# EAGLE design tms9918 (EAGLE 9.4.2)

## Sheet 1 of 2: Bus interface
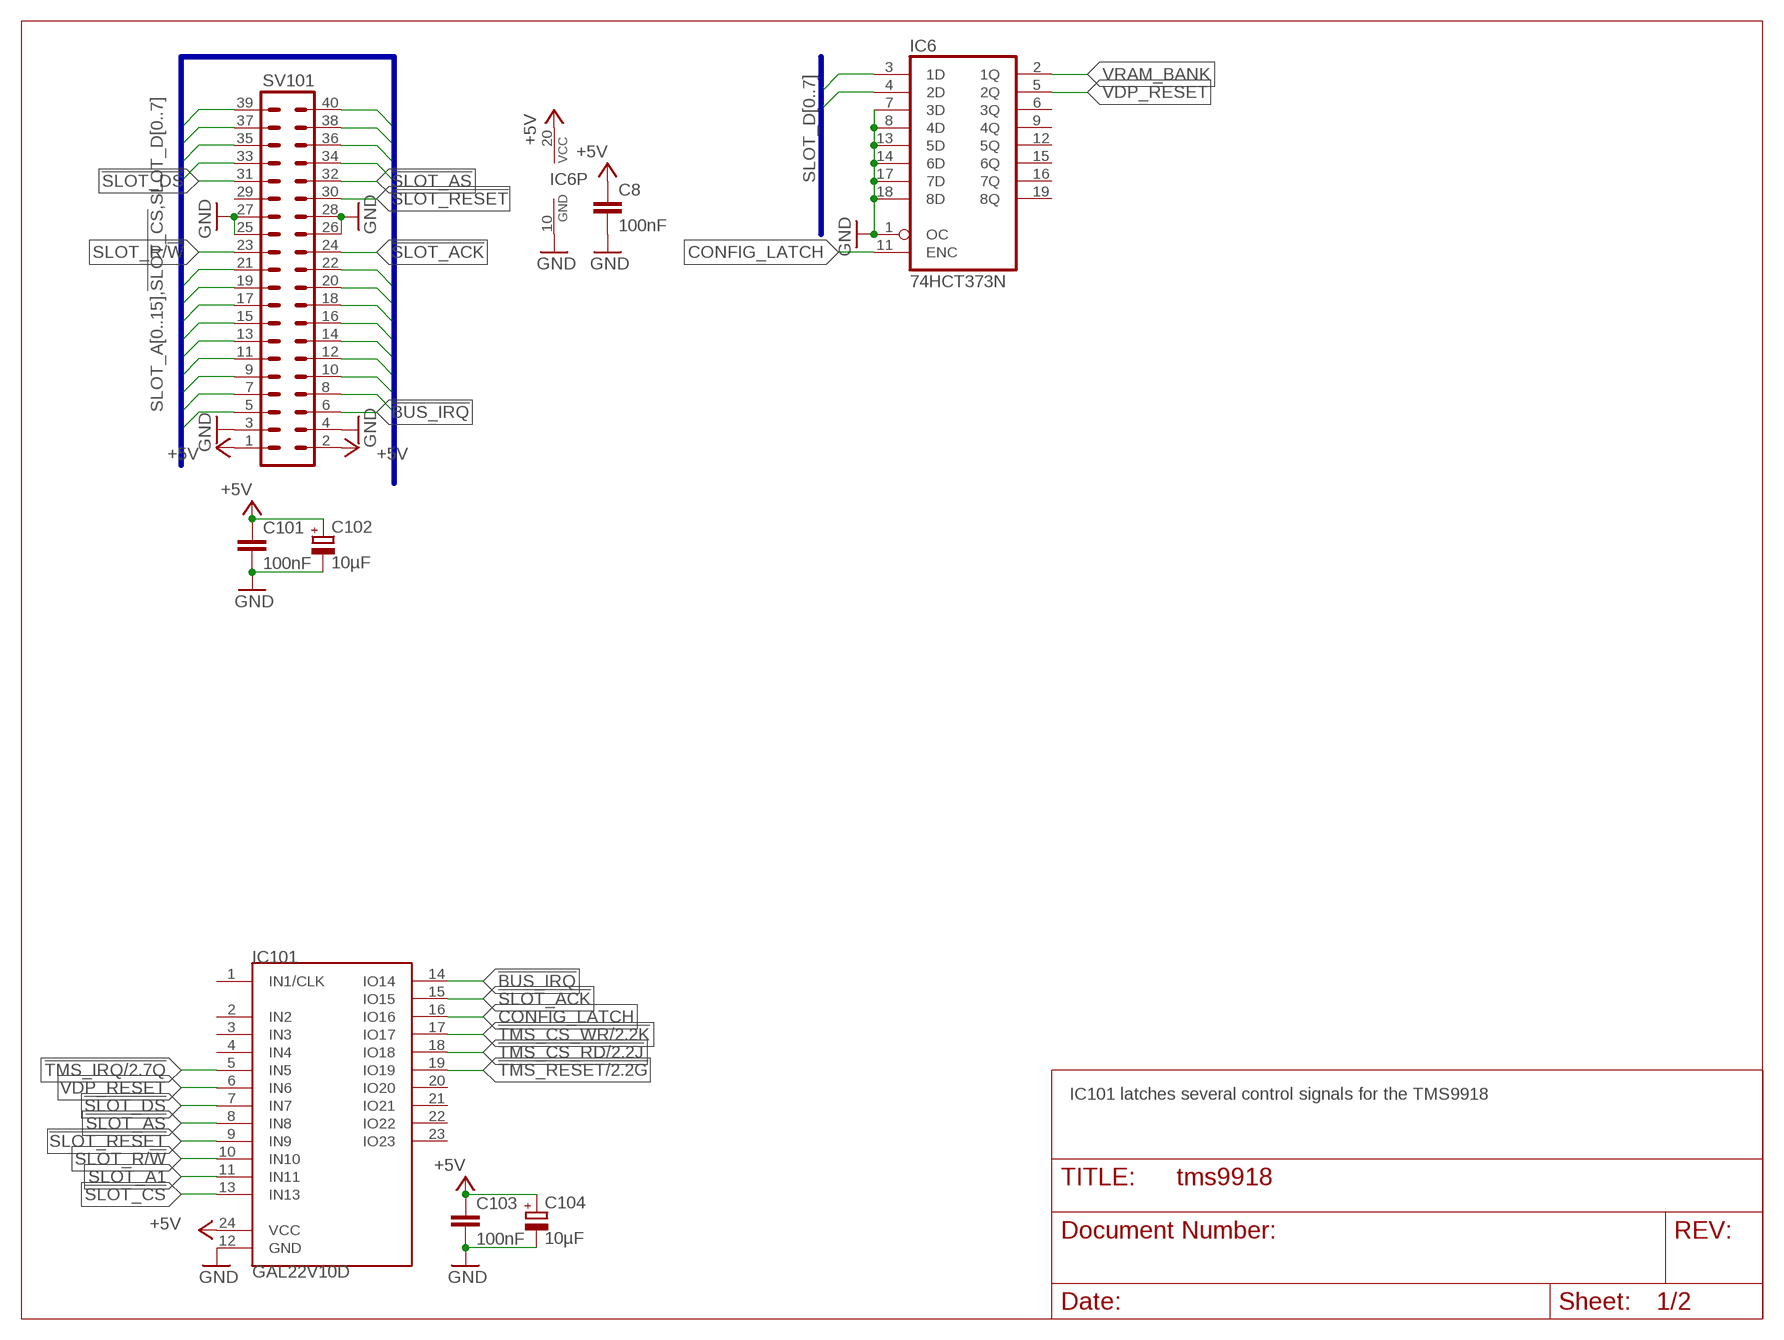
[diagram p0: schematic, sheet 1]

### Parts
C8  100nF  C-EUC0805  [C0805]
C101  100nF  C-EUC0805  [C0805]
C102  10µF  CPOL-EUSMCB  [SMC_B]
C103  100nF  C-EUC0805  [C0805]
C104  10µF  CPOL-EUSMCB  [SMC_B]
IC6  74HCT373N  [DIL20]
IC101  GAL22V10D  GAL22V10DIP24  [DIL24S]
SV101  MA20-2W  [MA20-2W]

### Nets
!BUS_IRQ: IC101.14(IO14) SV101.6
!SLOT_ACK: IC101.15(IO15) SV101.24
!SLOT_AS: IC101.8(IN8) SV101.32
!SLOT_CS: IC101.13(IN13) SV101.5
!SLOT_DS: IC101.7(IN7) SV101.31
!SLOT_RESET: IC101.9(IN9) SV101.30
!TMS_CS_RD: IC101.18(IO18) ; also sheet 2
!TMS_CS_WR: IC101.17(IO17) ; also sheet 2
!TMS_IRQ: IC101.5(IN5) ; also sheet 2
!TMS_RESET: IC101.19(IO19) ; also sheet 2
+5V: C8.1 C101.1 C102.+ C103.1 C104.+ IC6.20(VCC) IC101.24(VCC) SV101.1 SV101.2 ; also sheet 2
CONFIG_LATCH: IC6.11(ENC) IC101.16(IO16)
GND: C8.2 C101.2 C102.- C103.2 C104.- IC6.1(OC) IC6.7(3D) IC6.8(4D) IC6.10(GND) IC6.13(5D) IC6.14(6D) IC6.17(7D) IC6.18(8D) IC101.12(GND) SV101.3 SV101.4 SV101.25 SV101.26 SV101.27 SV101.28 ; also sheet 2
SLOT_A0: SV101.12 ; also sheet 2
SLOT_A1: IC101.11(IN11) SV101.10
SLOT_A2: SV101.8
SLOT_A3: SV101.7
SLOT_A4: SV101.9
SLOT_A5: SV101.11
SLOT_A6: SV101.14
SLOT_A7: SV101.13
SLOT_A8: SV101.16
SLOT_A9: SV101.15
SLOT_A10: SV101.18
SLOT_A11: SV101.17
SLOT_A12: SV101.20
SLOT_A13: SV101.19
SLOT_A14: SV101.22
SLOT_A15: SV101.21
SLOT_D0: IC6.3(1D) SV101.35 ; also sheet 2
SLOT_D1: IC6.4(2D) SV101.37 ; also sheet 2
SLOT_D2: SV101.39 ; also sheet 2
SLOT_D3: SV101.40 ; also sheet 2
SLOT_D4: SV101.38 ; also sheet 2
SLOT_D5: SV101.36 ; also sheet 2
SLOT_D6: SV101.34 ; also sheet 2
SLOT_D7: SV101.33 ; also sheet 2
SLOT_R/!W!: IC101.10(IN10) SV101.23
VDP_RESET: IC6.5(2Q) IC101.6(IN6)
VRAM_BANK: IC6.2(1Q) ; also sheet 2
Unconnected: IC6.6(3Q) IC6.9(4Q) IC6.12(5Q) IC6.15(6Q) IC6.16(7Q) IC6.19(8Q) IC101.1(IN1/CLK) IC101.2(IN2) IC101.3(IN3) IC101.4(IN4) IC101.20(IO20) IC101.21(IO21) IC101.22(IO22) IC101.23(IO23) SV101.29

### Buses
SLOT_A[0..15],!SLOT_CS,SLOT_D[0..7]
SLOT_D[0..7]

### Notes on the sheet
- IC101 latches several control signals for the TMS9918

## Sheet 2 of 2: Video Controller/DRAM Emulation
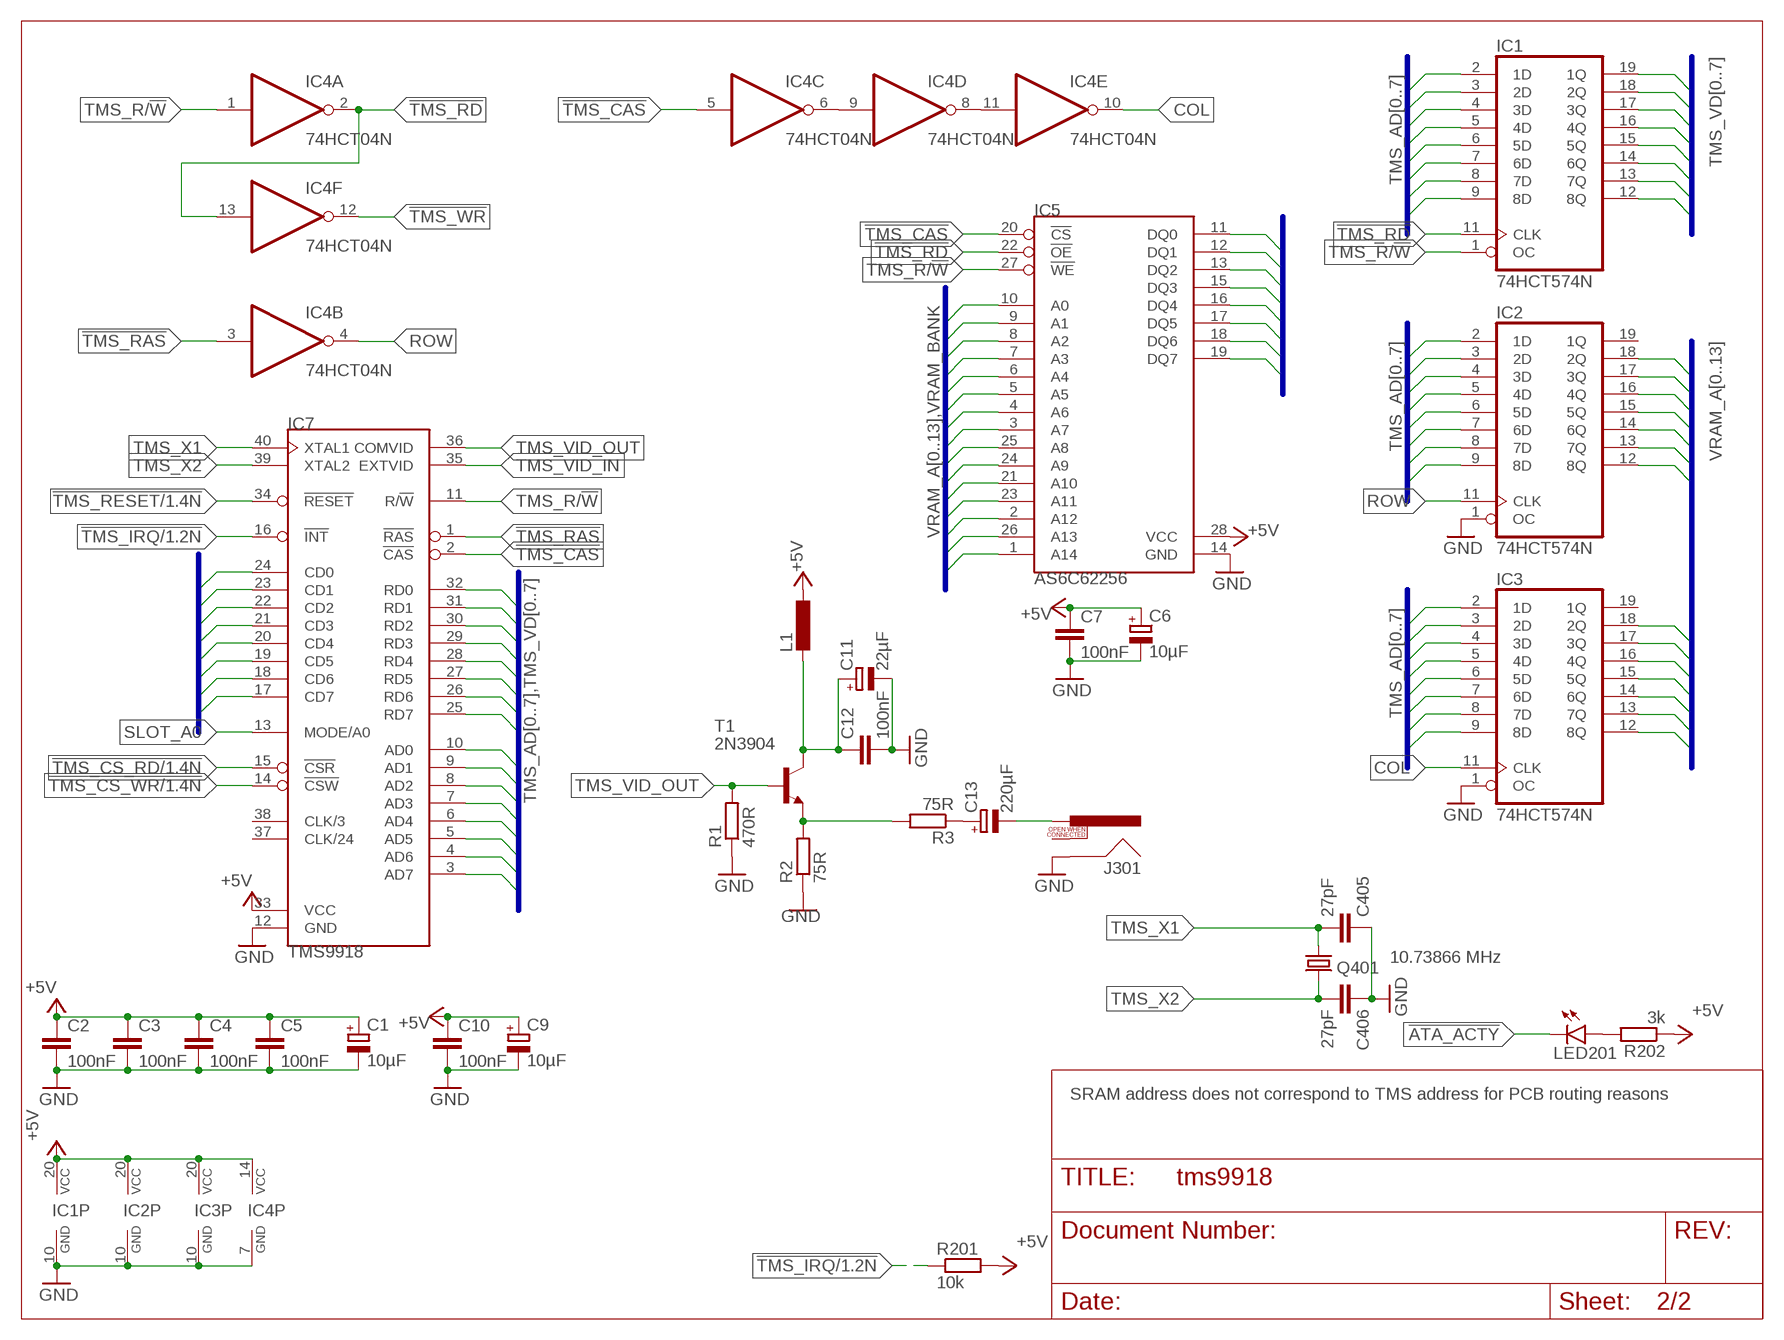
[diagram p1: schematic, sheet 2]

### Parts
C1  10µF  CPOL-EUSMCB  [SMC_B]
C2  100nF  C-EUC0805  [C0805]
C3  100nF  C-EUC0805  [C0805]
C4  100nF  C-EUC0805  [C0805]
C5  100nF  C-EUC0805  [C0805]
C6  10µF  CPOL-EUSMCB  [SMC_B]
C7  100nF  C-EUC0805  [C0805]
C9  10µF  CPOL-EUSMCB  [SMC_B]
C10  100nF  C-EUC0805  [C0805]
C11  22µF  CPOL-EUE2-5  [E2-5]
C12  100nF  C-EUC0805  [C0805]
C13  220µF  CPOL-EUE2.5-7  [E2,5-7]
C405  27pF  C-EUC0805  [C0805]
C406  27pF  C-EUC0805  [C0805]
IC1  74HCT574N  [DIL20]
IC2  74HCT574N  [DIL20]
IC3  74HCT574N  [DIL20]
IC4  74HCT04N  [DIL14]
IC5  AS6C62256  [DIL28-6]
IC7  TMS9918  [DIL40]
J301  RCALOCK  [RCA_LOCK]
L1  L-EUL2012C  [L2012C]
LED201  LEDCHIPLED_1206  [CHIPLED_1206]
Q401  10.73866 MHz  CRYSTALHC49S  [HC49/S]
R1  470R  R-EU_R2012  [R2012]
R2  75R  R-EU_R2012  [R2012]
R3  75R  R-EU_R2012  [R2012]
R201  10k  R-EU_R2012  [R2012]
R202  3k  R-EU_R2012  [R2012]
T1  2N3904  [TO92]

### Nets
!ATA_ACTY: LED201.C
!TMS_CAS: IC4.5(C:I) IC5.20(!CS) IC7.2(!CAS)
!TMS_CS_RD: IC7.15(!CSR) ; also sheet 1
!TMS_CS_WR: IC7.14(!CSW) ; also sheet 1
!TMS_IRQ: IC7.16(!INT) R201.1 ; also sheet 1
!TMS_RAS: IC4.3(B:I) IC7.1(!RAS)
!TMS_RD: IC1.11(CLK) IC4.2(A:O) IC4.13(F:I) IC5.22(!OE)
!TMS_RESET: IC7.34(!RESET) ; also sheet 1
!TMS_WR: IC4.12(F:O)
+5V: C1.+ C2.1 C3.1 C4.1 C5.1 C6.+ C7.1 C9.+ C10.1 IC1.20(VCC) IC2.20(VCC) IC3.20(VCC) IC4.14(P:VCC) IC5.28(VCC) IC7.33(VCC) L1.1 R201.2 R202.1 ; also sheet 1
COL: IC3.11(CLK) IC4.10(E:O)
GND: C1.- C2.2 C3.2 C4.2 C5.2 C6.- C7.2 C9.- C10.2 C11.- C12.2 C405.1 C406.1 IC1.10(GND) IC2.1(OC) IC2.10(GND) IC3.1(OC) IC3.10(GND) IC4.7(P:GND) IC5.14(GND) IC7.12(GND) J301.SHELL R1.1 R2.1 ; also sheet 1
N$1: IC4.8(D:O) IC4.11(E:I)
N$2: IC4.6(C:O) IC4.9(D:I)
N$3: C11.+ C12.1 L1.2 T1.1(C)
N$4: R2.2 R3.2 T1.3(E)
N$5: C13.+ R3.1
N$6: C13.- J301.PIN
N$7: LED201.A R202.2
ROW: IC2.11(CLK) IC4.4(B:O)
SLOT_A0: IC7.13(MODE/A0) ; also sheet 1
SLOT_D0: IC7.17(CD7) ; also sheet 1
SLOT_D1: IC7.18(CD6) ; also sheet 1
SLOT_D2: IC7.19(CD5) ; also sheet 1
SLOT_D3: IC7.20(CD4) ; also sheet 1
SLOT_D4: IC7.21(CD3) ; also sheet 1
SLOT_D5: IC7.22(CD2) ; also sheet 1
SLOT_D6: IC7.23(CD1) ; also sheet 1
SLOT_D7: IC7.24(CD0) ; also sheet 1
TMS_AD0: IC1.2(1D) IC2.9(8D) IC3.9(8D) IC7.10(AD0)
TMS_AD1: IC1.3(2D) IC2.8(7D) IC3.8(7D) IC7.9(AD1)
TMS_AD2: IC1.4(3D) IC2.7(6D) IC3.7(6D) IC7.8(AD2)
TMS_AD3: IC1.5(4D) IC2.6(5D) IC3.6(5D) IC7.7(AD3)
TMS_AD4: IC1.6(5D) IC2.5(4D) IC3.5(4D) IC7.6(AD4)
TMS_AD5: IC1.7(6D) IC2.4(3D) IC3.4(3D) IC7.5(AD5)
TMS_AD6: IC1.8(7D) IC2.3(2D) IC3.3(2D) IC7.4(AD6)
TMS_AD7: IC1.9(8D) IC2.2(1D) IC3.2(1D) IC7.3(AD7)
TMS_R/!W!: IC1.1(OC) IC4.1(A:I) IC5.27(!WE) IC7.11(R/!W!)
TMS_VD0: IC1.19(1Q) IC5.11(DQ0) IC7.32(RD0)
TMS_VD1: IC1.18(2Q) IC5.12(DQ1) IC7.31(RD1)
TMS_VD2: IC1.17(3Q) IC5.13(DQ2) IC7.30(RD2)
TMS_VD3: IC1.16(4Q) IC5.15(DQ3) IC7.29(RD3)
TMS_VD4: IC1.15(5Q) IC5.16(DQ4) IC7.28(RD4)
TMS_VD5: IC1.14(6Q) IC5.17(DQ5) IC7.27(RD5)
TMS_VD6: IC1.13(7Q) IC5.18(DQ6) IC7.26(RD6)
TMS_VD7: IC1.12(8Q) IC5.19(DQ7) IC7.25(RD7)
TMS_VID_IN: IC7.35(EXTVID)
TMS_VID_OUT: IC7.36(COMVID) R1.2 T1.2(B)
TMS_X1: C405.2 IC7.40(XTAL1) Q401.1
TMS_X2: C406.2 IC7.39(XTAL2) Q401.2
VRAM_A0: IC2.12(8Q) IC5.10(A0)
VRAM_A1: IC2.13(7Q) IC5.9(A1)
VRAM_A2: IC2.14(6Q) IC5.8(A2)
VRAM_A3: IC2.15(5Q) IC5.7(A3)
VRAM_A4: IC2.16(4Q) IC5.6(A4)
VRAM_A5: IC2.17(3Q) IC5.5(A5)
VRAM_A6: IC2.18(2Q) IC5.4(A6)
VRAM_A7: IC3.17(3Q) IC5.3(A7)
VRAM_A8: IC3.15(5Q) IC5.25(A8)
VRAM_A9: IC3.14(6Q) IC5.24(A9)
VRAM_A10: IC3.12(8Q) IC5.21(A10)
VRAM_A11: IC3.13(7Q) IC5.23(A11)
VRAM_A12: IC3.18(2Q) IC5.2(A12)
VRAM_A13: IC3.16(4Q) IC5.26(A13)
VRAM_BANK: IC5.1(A14) ; also sheet 1
Unconnected: IC2.19(1Q) IC3.19(1Q) IC7.37(CLK/24) IC7.38(CLK/3) J301.SWITCH

### Buses
TMS_VD[0..7]
VRAM_A[0..13]
TMS_AD[0..7]
VRAM_A[0..13],VRAM_BANK
TMS_AD[0..7],TMS_VD[0..7]
SLOT_D[0..7]

### Notes on the sheet
- SRAM address does not correspond to TMS address for PCB routing reasons

## Library data of the parts
C1 C6 C9 C102 C104 = rcl:CPOL-EU: POLARIZED CAPACITOR, European symbol; MOUSER: 581-TAJB106K020RNJV; SPICEPREFIX: C
C2-C5 C7 C8 C10 C12 C101 C103 = rcl:C-EU: CAPACITOR, European symbol; MOUSER: 710-885012207072; SPICEPREFIX: C
C11 = rcl:CPOL-EU: POLARIZED CAPACITOR, European symbol; MOUSER: 710-860010372002; SPICEPREFIX: C
C13 = rcl:CPOL-EU: POLARIZED CAPACITOR, European symbol; MOUSER: 710-860020373010; SPICEPREFIX: C
C405 C406 = rcl:C-EU: CAPACITOR, European symbol; MOUSER: 80-C0805C270K5HACTU; SPICEPREFIX: C
IC1-IC3 = 74xx-eu:74*574: 8-bit D type FLIP FLOP bus driver; MOUSER: 595-SN74HCT574N; MOUSER_SOCKET: 575-1104732041001000
IC4 = 74xx-eu:74*04: Hex INVERTER; MOUSER: 595-SN74HCT04N; MOUSER_SOCKET: 575-1104731441001000
IC5 = 68komputer:AS6C62256: AS6C62256 – 32K x 8 bit SRAM Datasheet <https://www.mouser.com/datasheet/2/12/AS6C62256%2023%20March%202016%20rev1.2-1288423.pdf>; MOUSER: 913-AS6C62256-55PCN; MOUSER_SOCKET: 575-1104762841001000
IC6 = 74xx-eu:74*373: Octal D type transparent LATCH, edge triggered; MOUSER: 595-SN74HCT373N; MOUSER_SOCKET: 575-1104732041001000
IC7 = 68komputer:TMS9918: TMSS9918 – Video Display Processor Datasheet <http://www.bitsavers.org/components/ti/TMS9900/TMS9918A_TMS9928A_TMS9929A_Video_Display_Processors_Data_Manual_Nov82.pdf>; MOUSER_SOCKET: 437-1108764041001101
IC101 = 68komputer:GAL22V10: GAL22V10D – Generic Array Logic Datasheet <http://web.mit.edu/6.115/www/document/gal22v10.pdf>; MOUSER_SOCKET: 575-11044324
J301 = SparkFun-Connectors:RCA: RCA Jack connector This is a right angle RCA jack connecotr. Commonly used for video or audio. Here is the connector we sell at SparkFun: RCA Jack <https://www.sparkfun.com/products/8631> (PRT-08631) Datasheet <http://www.sparkfun.com/datasheets/Prototyping/Connectors/RCA-Jack.pdf> It is not used on any active designs, however it was used on a couple retired products: RCA Jack Breakout [RETIRED] <https://www.sparkfun.com/products/8826> (PRT-08826) SparkFun On Screen Display Breakout - MAX7456 [RETIRED] <https://www.sparkfun.com/products/9168> (BOB-09168) You may also be interested in a cable: RCA Video Cable - 6' <https://www.sparkfun.com/products/11573> (CAB-11573); MOUSER: 502-PJRAN1X1U03AUX
L1 = rcl:L-EU: INDUCTOR, European symbol; MOUSER: 963-BK2125HS101-T; SPICEPREFIX: L
LED201 = led:LED: LED OSRAM: - CHIPLED LG R971, LG N971, LY N971, LG Q971, LY Q971, LO R971, LY R971 LH N974, LH R974 LS Q976, LO Q976, LY Q976 LO Q996 - Hyper CHIPLED LW Q18S LB Q993, LB Q99A, LB R99A - SideLED LS A670, LO A670, LY A670, LG A670, LP A670 LB A673, LV A673, LT A673, LW A673 LH A674 LY A675 LS A676, LA A676, LO A676, LY A676, LW A676 LS A679, LY A679, LG A679 - Hyper Micro SIDELED® LS Y876, LA Y876, LO Y876, LY Y876 LT Y87S - SmartLED LW L88C, LW L88S LB L89C, LB L89S, LG L890 LS L89K, LO L89K, LY L89K LS L896, LA L896, LO L896, LY L896 - TOPLED LS T670, LO T670, LY T670, LG T670, LP T670 LSG T670, LSP T670, LSY T670, LOP T670, LYG T670 LG T671, LOG T671, LSG T671 LB T673, LV T673, LT T673, LW T673 LH T674 LS T676, LA T676, LO T676, LY T676, LB T676, LH T676, LSB T676, LW T676 LB T67C, LV T67C, LT T67C, LS T67K, LO T67K, LY T67K, LW E67C LS E67B, LA E67B, LO E67B, LY E67B, LB E67C, LV E67C, LT E67C LW T67C LS T679, LY T679, LG T679 LS T770, LO T770, LY T770, LG T770, LP T770 LB T773, LV T773, LT T773, LW T773 LH T774 LS E675, LA E675, LY E675, LS T675 LS T776, LA T776, LO T776, LY T776, LB T776 LHGB T686 LT T68C, LB T68C - Hyper Mini TOPLED® LB M676 - Mini TOPLED Santana® LG M470 LS M47K, LO M47K, LY M47K Source: http://www.osram.convergy.de LUXEON: - LUMILED® LXK2-PW12-R00, LXK2-PW12-S00, LXK2-PW14-U00, LXK2-PW14-V00 LXK2-PM12-R00, LXK2-PM12-S00, LXK2-PM14-U00 LXK2-PE12-Q00, LXK2-PE12-R00, LXK2-PE12-S00, LXK2-PE14-T00, LXK2-PE14-U00 LXK2-PB12-K00, LXK2-PB12-L00, LXK2-PB12-M00, LXK2-PB14-N00, LXK2-PB14-P00, LXK2-PB14-Q00 LXK2-PR12-L00, LXK2-PR12-M00, LXK2-PR14-Q00, LXK2-PR14-R00 LXK2-PD12-Q00, LXK2-PD12-R00, LXK2-PD12-S00 LXK2-PH12-R00, LXK2-PH12-S00 LXK2-PL12-P00, LXK2-PL12-Q00, LXK2-PL12-R00 Source: www.luxeon.com KINGBRIGHT: KA-3528ASYC Source: www.kingbright.com; MOUSER: 710-156120VS75300
Q401 = crystal:CRYSTAL: CRYSTAL; MOUSER: 449-LFXTAL029962REEL; OC_FARNELL: 1667008; OC_NEWARK: unknown
R1 = rcl:R-EU_: RESISTOR, European symbol; MOUSER: 652-CR0805FX-4700ELF; SPICEPREFIX: R
R2 R3 = rcl:R-EU_: RESISTOR, European symbol; MOUSER: 652-CR0805FX-75R0ELF; SPICEPREFIX: R
R201 = rcl:R-EU_: RESISTOR, European symbol; MOUSER: 652-CR0805FX-1002ELF; SPICEPREFIX: R
R202 = rcl:R-EU_: RESISTOR, European symbol; MOUSER: 652-CR0805JW-302ELF; SPICEPREFIX: R
SV101 = con-lstb:MA20-2W: PIN HEADER; OC_FARNELL: unknown; OC_NEWARK: unknown
T1 = transistor-neu-to92:2N3904: NPN TRANSISTOR; MOUSER: 512-2N3904BU

## Net classes
0 default: width 0.203 mm

## Board
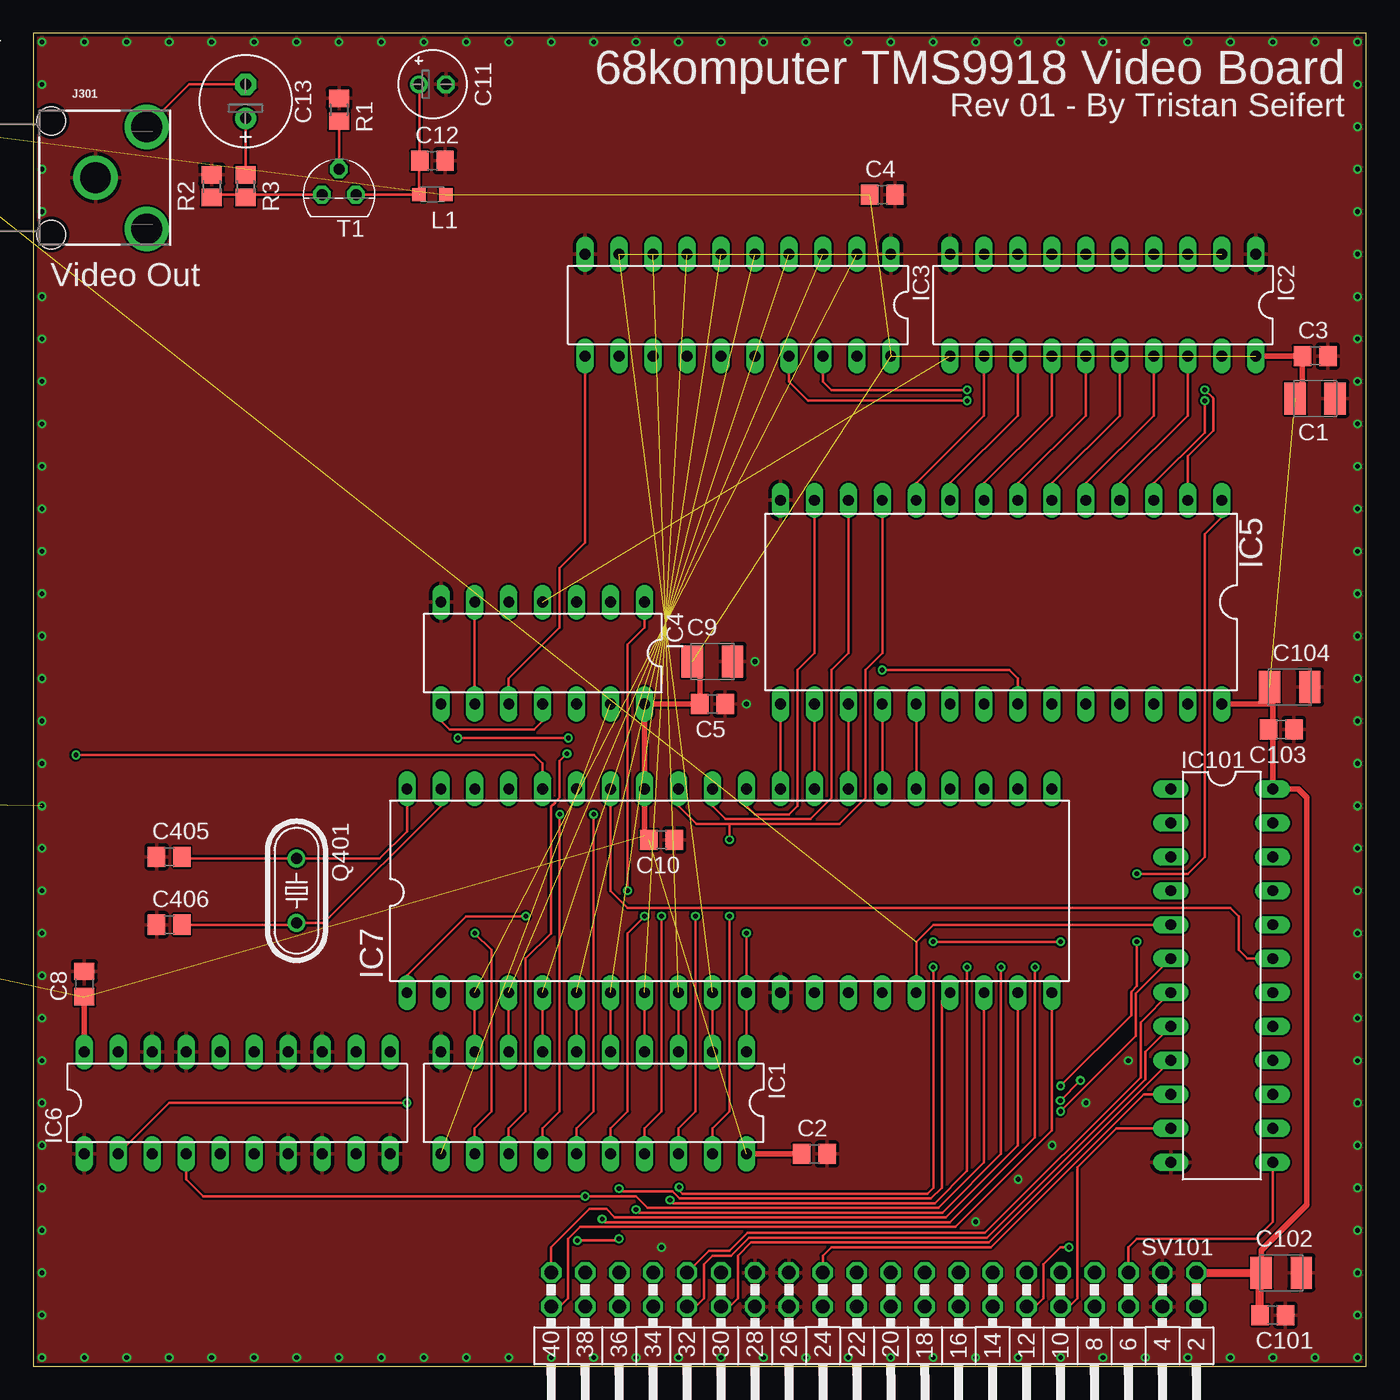
[diagram p2: board, top side]
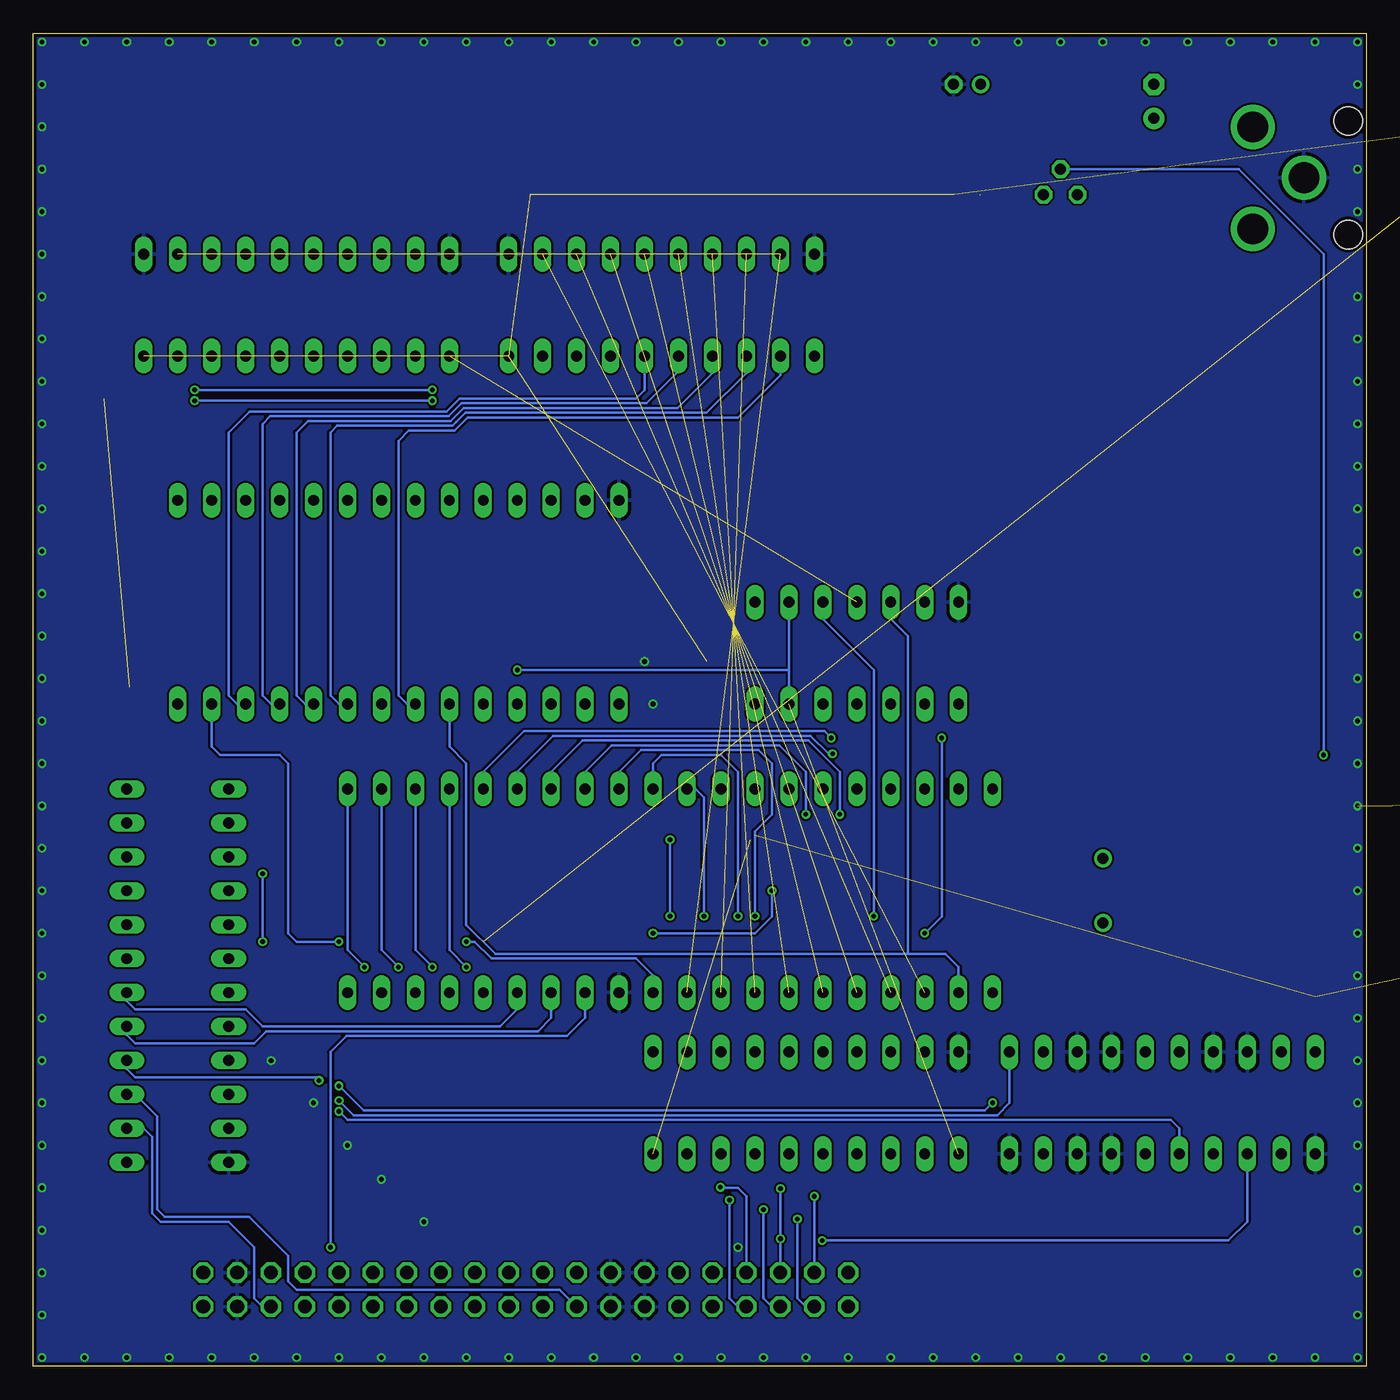
[diagram p3: board, bottom side, seen from below]

Size 99.69 x 99.69 mm. Coordinates in mm from the lower left corner, seen from the top.
Outline: 0,0 99.69,0 99.69,99.69 0,99.69 0,0
Copper layers (1*16): Top 0.035mm / dielectric 1.5mm / Bottom 0.035mm
Design rules "dirt_cheap_dirty_boards.v1.1": minimum track width 6mil, minimum drill 12mil, track to track 6mil, track to pad 6mil, pad to pad 6mil, via to via 6mil, smd to smd 0mil, copper to edge 10mil, drill to drill 10mil, minimum pad ring 10mil, minimum via ring 6mil, stop-mask expansion 2mil, vias tented up to drill 25mil, thermal gap 10mil

### Footprints (pad centres in the part's own frame; a part is rotated, then mirrored left to right if it is on the bottom)
SMC_B = smd 1.6 x 2.4: + -1.5,0; - 1.5,0
C0805 = smd 1.3 x 1.5: 1 -0.95,0; 2 0.95,0
E2-5 = drill 0.813 pad 1.27: + -1.016,0 | drill 0.813 pad 1.27 octagon: - 1.016,0
E2,5-7 = drill 0.813 pad 1.6: + -1.27,0 | drill 0.813 pad 1.6 octagon: - 1.27,0
DIL20 = drill 0.813 long: 1 -11.43,-3.81; 2 -8.89,-3.81; 3 -6.35,-3.81; 4 -3.81,-3.81; 5 -1.27,-3.81; 6 1.27,-3.81; 7 3.81,-3.81; 8 6.35,-3.81; 9 8.89,-3.81; 10 11.43,-3.81; 11 11.43,3.81; 12 8.89,3.81; 13 6.35,3.81; 14 3.81,3.81; 15 1.27,3.81; 16 -1.27,3.81; 17 -3.81,3.81; 18 -6.35,3.81; 19 -8.89,3.81; 20 -11.43,3.81
DIL14 = drill 0.813 long: 1 -7.62,-3.81; 2 -5.08,-3.81; 3 -2.54,-3.81; 4 0,-3.81; 5 2.54,-3.81; 6 5.08,-3.81; 7 7.62,-3.81; 8 7.62,3.81; 9 5.08,3.81; 10 2.54,3.81; 11 0,3.81; 12 -2.54,3.81; 13 -5.08,3.81; 14 -7.62,3.81
DIL28-6 = drill 0.813 long: 1 -16.51,-7.62; 2 -13.97,-7.62; 3 -11.43,-7.62; 4 -8.89,-7.62; 5 -6.35,-7.62; 6 -3.81,-7.62; 7 -1.27,-7.62; 8 1.27,-7.62; 9 3.81,-7.62; 10 6.35,-7.62; 11 8.89,-7.62; 12 11.43,-7.62; 13 13.97,-7.62; 14 16.51,-7.62; 15 16.51,7.62; 16 13.97,7.62; 17 11.43,7.62; 18 8.89,7.62; 19 6.35,7.62; 20 3.81,7.62; 21 1.27,7.62; 22 -1.27,7.62; 23 -3.81,7.62; 24 -6.35,7.62; 25 -8.89,7.62; 26 -11.43,7.62; 27 -13.97,7.62; 28 -16.51,7.62
DIL40 = drill 0.813 long: 1 -24.13,-7.62; 2 -21.59,-7.62; 3 -19.05,-7.62; 4 -16.51,-7.62; 5 -13.97,-7.62; 6 -11.43,-7.62; 7 -8.89,-7.62; 8 -6.35,-7.62; 9 -3.81,-7.62; 10 -1.27,-7.62; 11 1.27,-7.62; 12 3.81,-7.62; 13 6.35,-7.62; 14 8.89,-7.62; 15 11.43,-7.62; 16 13.97,-7.62; 17 16.51,-7.62; 18 19.05,-7.62; 19 21.59,-7.62; 20 24.13,-7.62; 21 24.13,7.62; 22 21.59,7.62; 23 19.05,7.62; 24 16.51,7.62; 25 13.97,7.62; 26 11.43,7.62; 27 8.89,7.62; 28 6.35,7.62; 29 3.81,7.62; 30 1.27,7.62; 31 -1.27,7.62; 32 -3.81,7.62; 33 -6.35,7.62; 34 -8.89,7.62; 35 -11.43,7.62; 36 -13.97,7.62; 37 -16.51,7.62; 38 -19.05,7.62; 39 -21.59,7.62; 40 -24.13,7.62
DIL24S = drill 0.813 long: 1 -13.97,-3.81; 2 -11.43,-3.81; 3 -8.89,-3.81; 4 -6.35,-3.81; 5 -3.81,-3.81; 6 -1.27,-3.81; 7 1.27,-3.81; 8 3.81,-3.81; 9 6.35,-3.81; 10 8.89,-3.81; 11 11.43,-3.81; 12 13.97,-3.81; 13 13.97,3.81; 14 11.43,3.81; 15 8.89,3.81; 16 6.35,3.81; 17 3.81,3.81; 18 1.27,3.81; 19 -1.27,3.81; 20 -3.81,3.81; 21 -6.35,3.81; 22 -8.89,3.81; 23 -11.43,3.81; 24 -13.97,3.81
RCA_LOCK = drill 2.3: PIN 4.03,3.802; SHELL 0.203,0; SWITCH 4.03,-3.827 | hole 2.134: -3.1,4.25; -3.1,-4.25
L2012C = smd 1 x 1: 1 -1,0; 2 1,0
CHIPLED_1206 = smd 1.5 x 1.5: A 0,-1.75; C 0,1.75
HC49/S = drill 0.813: 1 -2.413,0; 2 2.413,0
R2012 = smd 1.3 x 1.5: 1 -0.85,0; 2 0.85,0
MA20-2W = drill 1.016 octagon: 1 -24.13,-1.27; 2 -24.13,1.27; 3 -21.59,-1.27; 4 -21.59,1.27; 5 -19.05,-1.27; 6 -19.05,1.27; 7 -16.51,-1.27; 8 -16.51,1.27; 9 -13.97,-1.27; 10 -13.97,1.27; 11 -11.43,-1.27; 12 -11.43,1.27; 13 -8.89,-1.27; 14 -8.89,1.27; 15 -6.35,-1.27; 16 -6.35,1.27; 17 -3.81,-1.27; 18 -3.81,1.27; 19 -1.27,-1.27; 20 -1.27,1.27; 21 1.27,-1.27; 22 1.27,1.27; 23 3.81,-1.27; 24 3.81,1.27; 25 6.35,-1.27; 26 6.35,1.27; 27 8.89,-1.27; 28 8.89,1.27; 29 11.43,-1.27; 30 11.43,1.27; 31 13.97,-1.27; 32 13.97,1.27; 33 16.51,-1.27; 34 16.51,1.27; 35 19.05,-1.27; 36 19.05,1.27; 37 21.59,-1.27; 38 21.59,1.27; 39 24.13,-1.27; 40 24.13,1.27
TO92 = drill 0.813 octagon: 1 1.27,0; 2 0,1.905; 3 -1.27,0

### Placement (x,y rotation side)
C1  95.89,72.39 0 top
C2  58.42,15.88 0 top
C3  95.89,75.56 0 top
C4  63.5,87.63 0 top
C5  50.8,49.53 0 top
C6  -43.18,37.47 180 top  (outside the outline)
C7  -42.55,42.55 180 top  (outside the outline)
C8  3.81,28.57 90 top
C9  50.8,52.7 0 top
C10  46.99,39.37 0 top
C11  29.84,95.89 0 top
C12  29.84,90.17 0 top
C13  15.88,94.61 90 top
C101  92.71,3.81 0 top
C102  93.34,6.99 0 top
C103  93.34,47.62 0 top
C104  93.98,50.8 0 top
C405  10.16,38.1 0 top
C406  10.16,33.02 0 top
IC1  41.91,19.68 180 top
IC2  80.01,79.38 180 top
IC3  52.7,79.38 180 top
IC4  38.1,53.34 180 top
IC5  72.39,57.15 180 top
IC6  15.24,19.68 0 top
IC7  52.07,35.56 0 top
IC101  88.9,29.21 270 top
J301  4.45,88.9 0 top
L1  29.84,87.63 180 top
LED201  -7.62,97.79 270 top  (outside the outline)
Q401  19.68,35.56 270 top
R1  22.86,93.98 270 top
R2  13.34,88.27 270 top
R3  15.88,88.27 270 top
R201  -12.7,93.34 180 top  (outside the outline)
R202  -12.7,97.79 0 top  (outside the outline)
SV101  62.87,5.71 180 top
T1  22.86,87.63 0 top

### Tracks (layer width: path | path; a pad name or v marks a point on that pad's centre or on a via)
!BUS_IRQ
  Bottom 0.203: SV101.6 82.55,4.45 83.19,5.08 83.19,8.89 85.09,10.79 90.17,10.79 90.81,11.43 90.81,17.14 91.44,17.78 IC101.14
!SLOT_ACK
  Bottom 0.203: SV101.24 60.33,5.71 80.01,5.71 80.64,6.35 80.64,8.26 83.54,11.15 89.89,11.15 90.45,11.71 90.45,18.69 92.08,20.32 IC101.15
!SLOT_AS
  Top 0.203: IC101.8 83.19,23.5 83.19,21.46 71.33,9.6 53.55,9.6 52.2,8.26 50.8,8.26 50.16,7.62 50.16,5.08 49.53,4.45 SV101.32
!SLOT_CS
  Top 0.203: SV101.5 81.92,8.89 82.55,9.53 91.44,9.53 92.71,10.79 IC101.13
!SLOT_DS
  Top 0.203: SV101.31 50.52,8.61 52.05,8.61 53.4,9.96 71.18,9.96 82.83,21.61 82.83,25.73 85.04,27.94 IC101.7
!SLOT_RESET
  Top 0.203: SV101.30 52.07,4.45 52.7,5.08 52.7,8.26 53.7,9.25 71.48,9.25 IC101.9
!TMS_CAS
  Bottom 0.203: IC5.20 68.58,46.35 67.31,45.09 67.31,33.02 65.13,30.84 34.29,30.84 | IC7.2 30.48,29.84 31.47,30.84 34.29,30.84 | IC4.5 35.56,55.88 34.29,54.61 34.29,30.84
!TMS_CS_RD
  Bottom 0.203: IC7.15 63.5,26.67 64.77,25.4 82.55,25.4 83.82,26.67 92.08,26.67 92.71,27.3 IC101.18
!TMS_CS_WR
  Bottom 0.203: IC7.14 60.96,26.04 61.95,25.04 82.27,25.04 83.19,24.13 92.08,24.13 92.71,24.77 IC101.17
!TMS_IRQ  (1 unrouted)
  Top 0.203: IC101.5 67.31,33.02 66.04,31.75 IC7.16
!TMS_RAS  (via drill 0.35)
  Top 0.203: v36.83,33.66 32.38,33.66 27.94,29.21 IC7.1
  Bottom 0.203: IC4.3 40.64,55.88 36.83,52.07 v36.83,33.66
!TMS_RD  (via drill 0.35)  (1 unrouted)
  Top 0.203: v63.5,52.07 73.03,52.07 73.66,51.44 IC5.22
  Bottom 0.203: IC4.2 43.18,52.07 | 43.18,52.07 IC4.13 | v63.5,52.07 43.18,52.07
!TMS_RESET
  Top 0.203: IC7.34 43.18,35.56 44.45,34.29 89.53,34.29 90.17,33.66 90.17,31.11 90.81,30.48 IC101.19
+5V  (11 unrouted)
  Top 0.203: 49.85,52.16 C9.+
  Top 0.406: C104.+ 92.71,50.57 92.71,49.53 | 92.71,49.53 92.71,47.94 C103.1 92.71,47.31 IC101.24 94.61,43.18 95.25,42.55 95.25,12.06 91.84,8.66 C102.+ | IC5.28 92.71,49.53 | IC1.20 C2.1 | IC2.20 C3.1 94.94,72.94 C1.+ | 49.85,52.16 C5.1 IC4.14 IC7.33 45.72,39.69 C10.1 | C8.1 IC6.20
  Top 0.61: SV101.2 SV101.1 C102.+ 91.76,6.9 C101.1
COL
  Top 0.203: IC3.11 41.27,61.59 39.37,59.69 39.37,55.24 35.56,51.44 IC4.10
CONFIG_LATCH  (via drill 0.35)
  Top 0.203: v76.82,19.86 v78.33,21.37
  Bottom 0.203: IC6.11 26.67,19.68 27.58,18.77 75.73,18.77 v76.82,19.86 | v78.33,21.37 78.55,21.59 92.08,21.59 92.71,22.23 IC101.16
GND  (via drill 0.35)  (2 unrouted)
  other vias: 0.64,0.64 0.64,3.81 0.64,6.99 0.64,10.16 0.64,13.34 0.64,16.51 0.64,19.68 0.64,22.86 0.64,26.04 0.64,29.21 0.64,32.38 0.64,35.56 0.64,38.73 0.64,41.91 0.64,45.09 0.64,48.26 0.64,51.44 0.64,54.61 0.64,57.78 0.64,60.96 0.64,64.14 0.64,67.31 0.64,70.48 0.64,73.66 0.64,76.83 0.64,80.01 0.64,86.36 0.64,89.53 0.64,95.89 0.64,99.06 3.81,0.64 6.99,0.64 10.16,0.64 13.34,0.64 16.51,0.64 19.68,0.64 22.86,0.64 26.04,0.64 29.21,0.64 32.38,0.64 35.56,0.64 38.73,0.64 41.91,0.64 45.09,0.64 48.26,0.64 51.44,0.64 54.61,0.64 57.78,0.64 60.96,0.64 64.14,0.64 67.31,0.64 70.48,0.64 73.66,0.64 76.83,0.64 80.01,0.64 83.19,0.64 86.36,0.64 89.53,0.64 92.71,0.64 95.89,0.64 99.06,0.64 99.06,3.81 99.06,6.99 99.06,10.16 99.06,13.34 99.06,16.51 99.06,19.68 99.06,22.86 99.06,26.04 99.06,29.21 99.06,32.38 99.06,35.56 99.06,38.73 99.06,41.91 99.06,45.09 99.06,48.26 99.06,51.44 99.06,54.61 99.06,57.78 99.06,60.96 99.06,64.14 99.06,67.31 99.06,70.48 99.06,73.66 99.06,76.83 99.06,80.01 99.06,83.19 99.06,86.36 99.06,89.53 99.06,92.71 99.06,95.89 99.06,99.06 95.89,99.06 92.71,99.06 89.53,99.06 86.36,99.06 83.19,99.06 80.01,99.06 76.83,99.06 73.66,99.06 70.48,99.06 67.31,99.06 64.14,99.06 60.96,99.06 57.78,99.06 54.61,99.06 51.44,99.06 48.26,99.06 45.09,99.06 41.91,99.06 38.73,99.06 35.56,99.06 32.38,99.06 29.21,99.06 26.04,99.06 22.86,99.06 19.68,99.06 16.51,99.06 13.34,99.06 10.16,99.06 6.99,99.06 3.81,99.06 46.99,8.89 53.34,49.53 53.98,52.7 70.48,10.79 76.2,16.51 78.74,19.68 81.92,22.86 73.66,13.97
  pour Bottom: 0,0 0,99.69 99.69,99.69 99.69,0 0.64,0
  pour Top: 0,0 0,99.69 99.69,99.69 99.69,0 0.64,0
N$1
  Top 0.203: IC4.8 30.48,48.26 31.11,47.62 37.47,47.62 38.1,48.26 IC4.11
N$2
  Top 0.203: IC4.9 IC4.6
N$3  (1 unrouted)
  Top 0.203: 28.89,87.63 T1.1 | C11.+ 28.89,95.82 C12.1 28.84,90.12 L1.2
N$4
  Top 0.203: T1.3 16.09,87.63 R3.2 15.46,87.42 15.24,87.63 13.55,87.63 R2.2
N$5
  Top 0.203: C13.+ R3.1
N$6
  Top 0.203: J301.PIN 11.66,95.89 C13.-
N$7  (1 unrouted)
ROW  (1 unrouted)
SLOT_A0  (via drill 0.35)
  Top 0.203: SV101.12 74.93,4.45 75.56,5.08 75.56,7.62 76.83,8.89 v77.47,8.89
  Bottom 0.203: IC7.13 58.42,26.04 59.77,24.69 76.28,24.69 77.47,23.5 v77.47,8.89
SLOT_A1
  Top 0.203: SV101.10 77.47,4.45 78.11,5.08 78.11,14.87 81.02,17.78 IC101.11
SLOT_D0  (via drill 0.35)
  Top 0.203: IC7.17 67.94,27.3 67.94,13.34 67.16,12.54 48.32,12.54 47.81,13.06 44.09,13.06 43.84,13.31 | 43.87,13.34 43.84,13.31 | 43.84,13.31 v43.81,13.28 | v40.69,9.39 43.68,9.39 v43.81,9.53
  Bottom 0.203: v43.81,13.28 v43.81,9.53 SV101.35 | IC6.3 8.89,10.79 10.29,9.39 v40.69,9.39
SLOT_D1  (via drill 0.35)
  Top 0.203: IC7.18 71.12,15.24 67.71,11.83 45.95,11.83 45.09,12.7 v41.27,12.7 12.7,12.7 11.43,13.97 IC6.4
  Bottom 0.203: v41.27,12.7 SV101.37
SLOT_D2
  Top 0.203: SV101.39 38.73,8.89 41.59,11.75 42.86,11.75 43.49,11.12 68.27,11.12 73.66,16.51 IC7.19
SLOT_D3
  Top 0.203: IC7.20 76.2,17.65 68.96,10.41 40.89,10.41 40.01,9.53 40.01,5.08 39.37,4.45 SV101.40
SLOT_D4  (via drill 0.35)
  Top 0.203: v42.55,10.99 42.77,10.77 68.58,10.77 74.93,17.12 v74.93,29.84
  Bottom 0.203: IC7.21 76.2,31.11 v74.93,29.84 | v42.55,10.99 42.55,5.08 41.91,4.45 SV101.38
SLOT_D5  (via drill 0.35)
  Top 0.203: v45.09,11.7 45.31,11.48 67.99,11.48 72.39,15.88 v72.39,29.84
  Bottom 0.203: IC7.22 73.66,31.11 v72.39,29.84 | v45.09,11.7 45.09,5.08 44.45,4.45 SV101.36
SLOT_D6  (via drill 0.35)
  Top 0.203: v47.62,12.41 47.85,12.19 67.43,12.19 69.85,14.61 v69.85,29.84
  Bottom 0.203: IC7.23 71.12,31.11 v69.85,29.84 | v47.62,12.41 47.62,5.08 46.99,4.45 SV101.34
SLOT_D7  (via drill 0.35)
  Top 0.203: v67.31,29.84 67.31,13.34 66.88,12.9 48.56,12.9 48.3,13.16 v48.3,13.38
  Bottom 0.203: IC7.24 68.58,31.11 v67.31,29.84 | SV101.33 46.35,12.7 46.99,13.34 48.26,13.34 v48.3,13.38
SLOT_R/!W!
  Top 0.203: SV101.23 59.05,8.26 59.69,8.89 71.62,8.89 83.05,20.32 IC101.10
TMS_AD0  (2 unrouted)
  Top 0.203: IC1.2 IC7.10
TMS_AD1  (2 unrouted)
  Top 0.203: IC7.9 IC1.3
TMS_AD2  (2 unrouted)
  Top 0.203: IC1.4 IC7.8
TMS_AD3  (2 unrouted)
  Top 0.203: IC7.7 IC1.5
TMS_AD4  (2 unrouted)
  Top 0.203: IC1.6 IC7.6
TMS_AD5  (2 unrouted)
  Top 0.203: IC7.5 IC1.7
TMS_AD6  (2 unrouted)
  Top 0.203: IC1.8 IC7.4
TMS_AD7  (2 unrouted)
  Top 0.203: IC7.3 IC1.9
TMS_R/!W!  (via drill 0.35)
  Top 0.203: v67.31,31.75 v76.83,31.75 | IC4.1 45.72,55.24 44.45,53.98 v44.45,35.56 | v53.34,32.38 IC7.11 IC1.1
  Bottom 0.203: IC7.11 53.34,29.21 54.61,30.48 65.41,30.48 66.67,31.75 v67.31,31.75 | v76.83,31.75 80.01,31.75 80.64,32.38 80.64,45.09 81.28,45.72 85.72,45.72 86.36,46.35 IC5.27 | v44.45,35.56 44.45,33.66 45.72,32.38 v53.34,32.38
TMS_VD0  (via drill 0.35)
  Top 0.203: IC5.11 63.5,53.34 62.23,52.07 62.23,42.5 60.3,40.56 52.07,40.56 | 52.07,40.56 49.61,40.56 48.26,41.91 IC7.32 | IC1.19 50.8,17.78 52.07,19.05 v52.07,33.66 | v52.07,39.37 52.07,40.56
  Bottom 0.203: v52.07,33.66 v52.07,39.37
TMS_VD1  (via drill 0.35)
  Top 0.203: IC5.12 60.96,53.34 59.69,52.07 59.69,42.5 58.11,40.92 51.79,40.92 50.8,41.91 IC7.31 | IC1.18 48.26,17.78 49.53,19.05 v49.53,33.66
  Bottom 0.203: v49.53,33.66 49.53,42.55 50.16,43.18 IC7.31
TMS_VD2  (via drill 0.35)
  Top 0.203: IC5.13 58.42,53.34 57.15,52.07 57.15,41.91 56.52,41.27 53.98,41.27 53.34,41.91 IC7.30 | IC1.17 45.72,17.78 46.99,19.05 v46.99,33.66
  Bottom 0.203: v46.99,33.66 46.99,44.45 48.26,45.72 52.7,45.72 53.34,45.09 IC7.30
TMS_VD3  (via drill 0.35)
  Top 0.203: IC5.15 IC7.29 | IC1.16 43.18,17.78 44.45,19.05 44.45,32.38 v45.72,33.66
  Bottom 0.203: v45.72,33.66 45.72,40.01 44.45,41.27 44.45,45.09 45.44,46.08 54.25,46.08 55.88,44.45 IC7.29
TMS_VD4  (via drill 0.35)
  Top 0.203: IC7.28 IC5.16 | IC1.15 40.64,17.78 41.91,19.05 v41.91,41.27
  Bottom 0.203: v41.91,41.27 41.91,44.45 43.89,46.43 56.44,46.43 58.42,44.45 IC7.28
TMS_VD5  (via drill 0.35)
  Top 0.203: IC5.17 IC7.27 | IC1.14 38.1,17.78 39.37,19.05 v39.37,41.27
  Bottom 0.203: v39.37,41.27 39.37,44.45 41.71,46.79 58.62,46.79 60.96,44.45 IC7.27
TMS_VD6  (via drill 0.35)
  Top 0.203: IC7.26 IC5.18 | IC1.13 35.56,17.78 36.83,19.05 36.83,30.48 38.73,32.38 38.73,41.86 39.01,42.14 39.01,42.19 39.37,42.55 39.37,45.27 v39.91,45.81
  Bottom 0.203: v39.91,45.81 40.23,45.81 41.56,47.14 60.81,47.14 63.5,44.45 IC7.26
TMS_VD7  (via drill 0.35)
  Top 0.203: IC5.19 IC7.25 | v40.01,46.99 v31.75,46.99 | v33.02,32.38 34.29,31.11 34.29,19.05 33.02,17.78 IC1.12
  Bottom 0.203: IC7.25 66.04,44.45 62.99,47.5 40.51,47.5 v40.01,46.99 | v33.02,32.38 31.75,33.66 v31.75,46.99
TMS_VID_OUT  (via drill 0.35)
  Top 0.203: T1.2 R1.2 | IC7.36 38.1,45.09 37.47,45.72 v3.17,45.72
  Bottom 0.203: v3.17,45.72 3.17,83.19 9.53,89.53 T1.2
TMS_X1
  Top 0.203: C405.2 11.24,37.97 Q401.1 25.91,37.97 27.94,40.01 IC7.40
TMS_X2
  Top 0.203: C406.2 19.56,33.02 Q401.2 21.72,33.15 30.48,41.91 IC7.39
VDP_RESET  (via drill 0.35)
  Top 0.203: v76.83,19.05 82.47,24.69 82.47,27.86 IC101.6
  Bottom 0.203: IC6.5 13.97,17.78 14.61,18.41 76.2,18.41 v76.83,19.05
VRAM_A0
  Top 0.203: IC5.10 66.04,66.04 71.12,71.12 IC2.12
VRAM_A1
  Top 0.203: IC2.13 73.66,71.12 68.58,66.04 IC5.9
VRAM_A2
  Top 0.203: IC5.8 71.12,66.04 76.2,71.12 IC2.14
VRAM_A3
  Top 0.203: IC2.15 78.74,71.12 73.66,66.04 IC5.7
VRAM_A4
  Top 0.203: IC2.16 81.28,71.12 76.2,66.04 IC5.6
VRAM_A5
  Top 0.203: IC5.5 78.74,66.04 83.82,71.12 IC2.17
VRAM_A6
  Top 0.203: IC2.18 86.36,71.12 81.28,66.04 IC5.4
VRAM_A7  (via drill 0.35)
  Top 0.203: IC3.17 56.52,73.66 57.96,72.22 v69.85,72.22 | v87.63,72.22 87.63,69.85 83.82,66.04 IC5.3
  Bottom 0.203: v69.85,72.22 v87.63,72.22
VRAM_A8
  Bottom 0.203: IC5.25 81.92,49.53 82.55,50.16 82.55,70.48 81.98,71.06 68.64,71.06 67.67,72.03 53.83,72.03 51.44,74.43 IC3.15
VRAM_A9
  Bottom 0.203: IC5.24 79.38,49.53 80.01,50.16 80.01,69.85 79.16,70.7 68.5,70.7 67.52,71.68 51.51,71.68 48.9,74.3 IC3.14
VRAM_A10
  Bottom 0.203: IC5.21 71.75,49.53 72.39,50.16 72.39,69.22 71.62,69.99 68.2,69.99 67.22,70.97 46.99,70.97 43.81,74.14 IC3.12
VRAM_A11
  Bottom 0.203: IC5.23 76.83,49.53 77.47,50.16 77.47,69.85 76.98,70.34 68.35,70.34 68.08,70.62 67.37,71.32 49.33,71.32 46.35,74.3 IC3.13
VRAM_A12  (via drill 0.35)
  Top 0.203: IC3.18 59.05,73.66 59.69,73.03 v69.85,73.03 | IC5.2 86.36,68.08 88.27,69.98 88.27,72.39 88.21,72.44 88.21,72.46 87.64,73.03 v87.63,73.03
  Bottom 0.203: v69.85,73.03 v87.63,73.03
VRAM_A13
  Bottom 0.203: IC5.26 84.45,49.53 85.09,50.16 85.09,69.85 83.53,71.41 68.79,71.41 67.81,72.39 54.61,72.39 53.98,73.03 IC3.16
VRAM_BANK  (via drill 0.35)
  Top 0.203: IC6.2 10.16,19.68 v27.94,19.68 | v76.83,20.95 82.12,26.24 82.12,28.01 82.55,28.44 v82.55,31.75 | v82.55,36.83 86.36,36.83 87.63,38.1 87.63,62.23 88.9,63.5 IC5.1
  Bottom 0.203: v27.94,19.68 28.5,19.13 75.01,19.13 v76.83,20.95 | v82.55,31.75 v82.55,36.83

### Text on the board
tNames: 68komputer TMS9918 Video Board | Rev 01 - By Tristan Seifert | Video Out